# EasyEDA schematic Simulation.json
TITLE: Sheet_1; REV: 1.0; Date: 2026-07-13; Sheet: 1/1; Company: Your Company
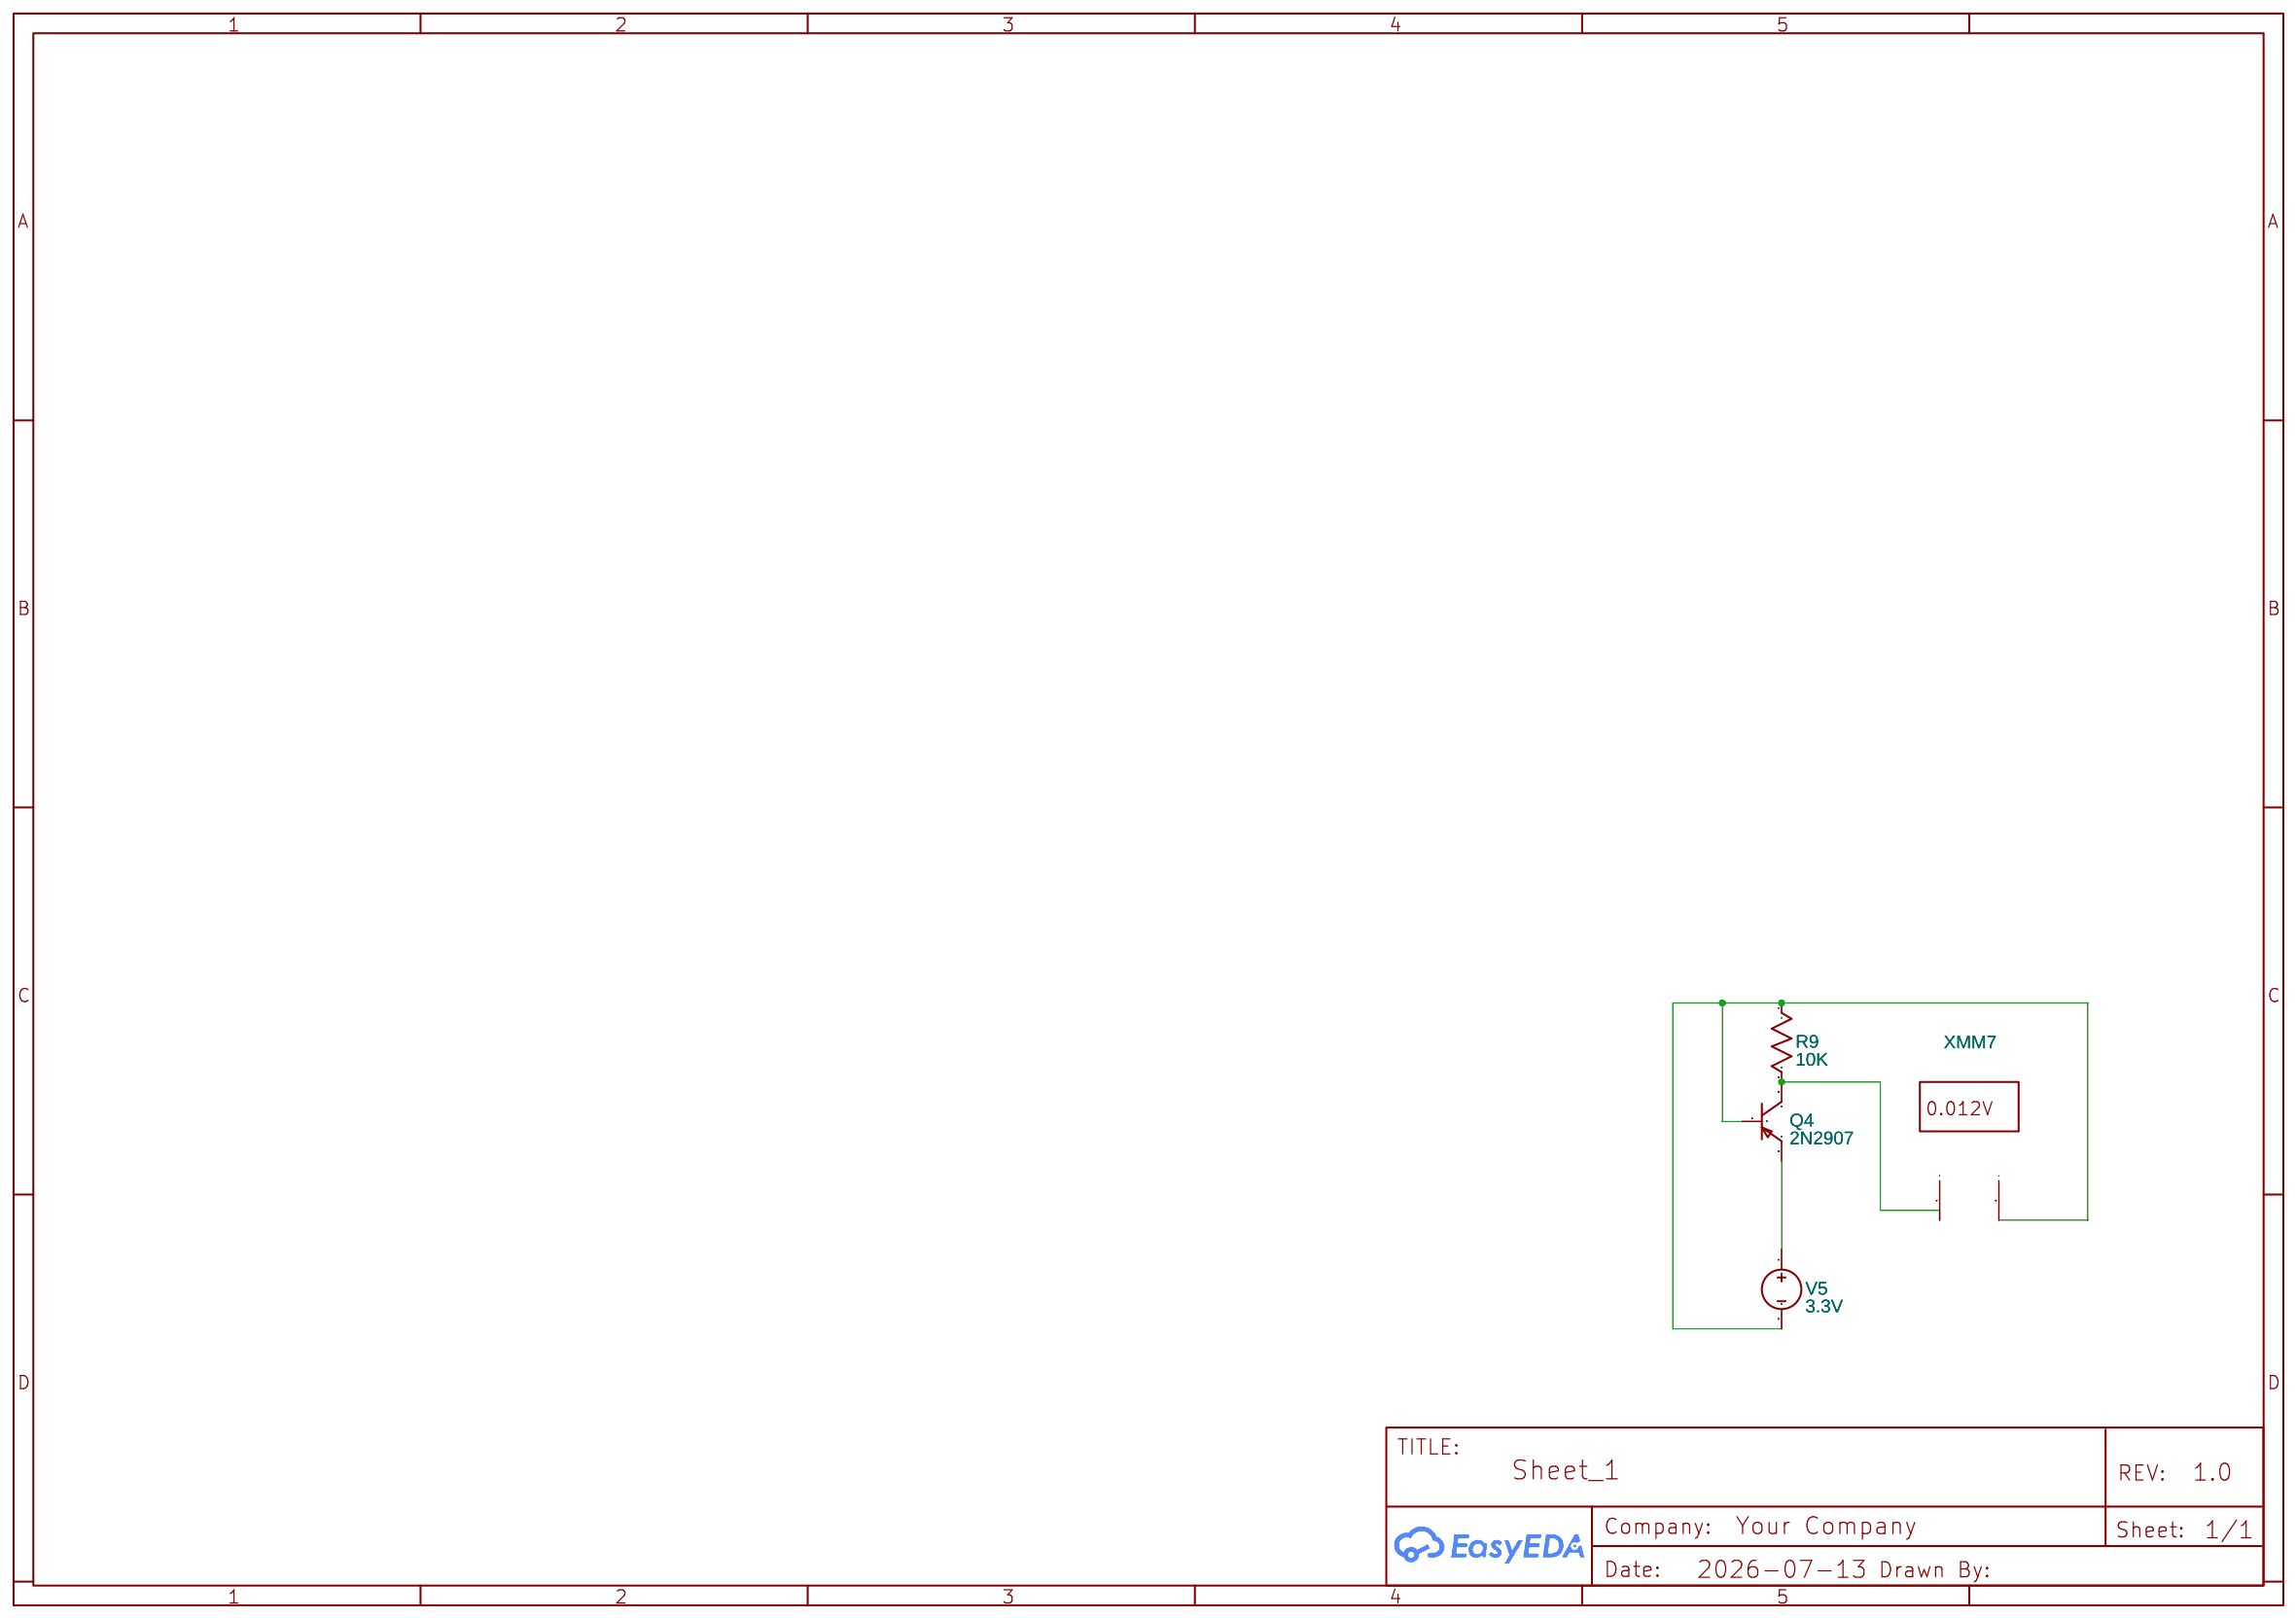
[diagram p0: schematic sheet]

## Parts
Q4  2N2907  [TO-92-3_L4.9-W3.7-P1.27-L]
R9  10K  [R0603]
V5  3.3V  [HDR1X2]
XMM7  Multimeter

## Library data of the parts
Q4 = 2N2907: Contributor: EasyEDA; sim: true
R9 = R_0603_US: Contributor: LCEDA_Lib
V5 = VDC: Contributor: EasyEDA; sim: true
XMM7 = MULTIMETER: Supplier: LCSC; Multimeter Type: Voltmeter; Power Type: AC; Voltmeter resistance: 10μ; Ammeter resistance: 1G; NameDisplay: 0; Contributor: EasyEDA; sim: true

## Nets
Net-(Q4-1): Q4.1(C) R9.2 XMM7.1(+)
Net-(Q4-2): Q4.2(B) R9.1 V5.2 XMM7.2(I)
Net-(Q4-3): Q4.3(E) V5.1
